# EAGLE schematic NeoPI_W_v34 (EAGLE 9.7.0)
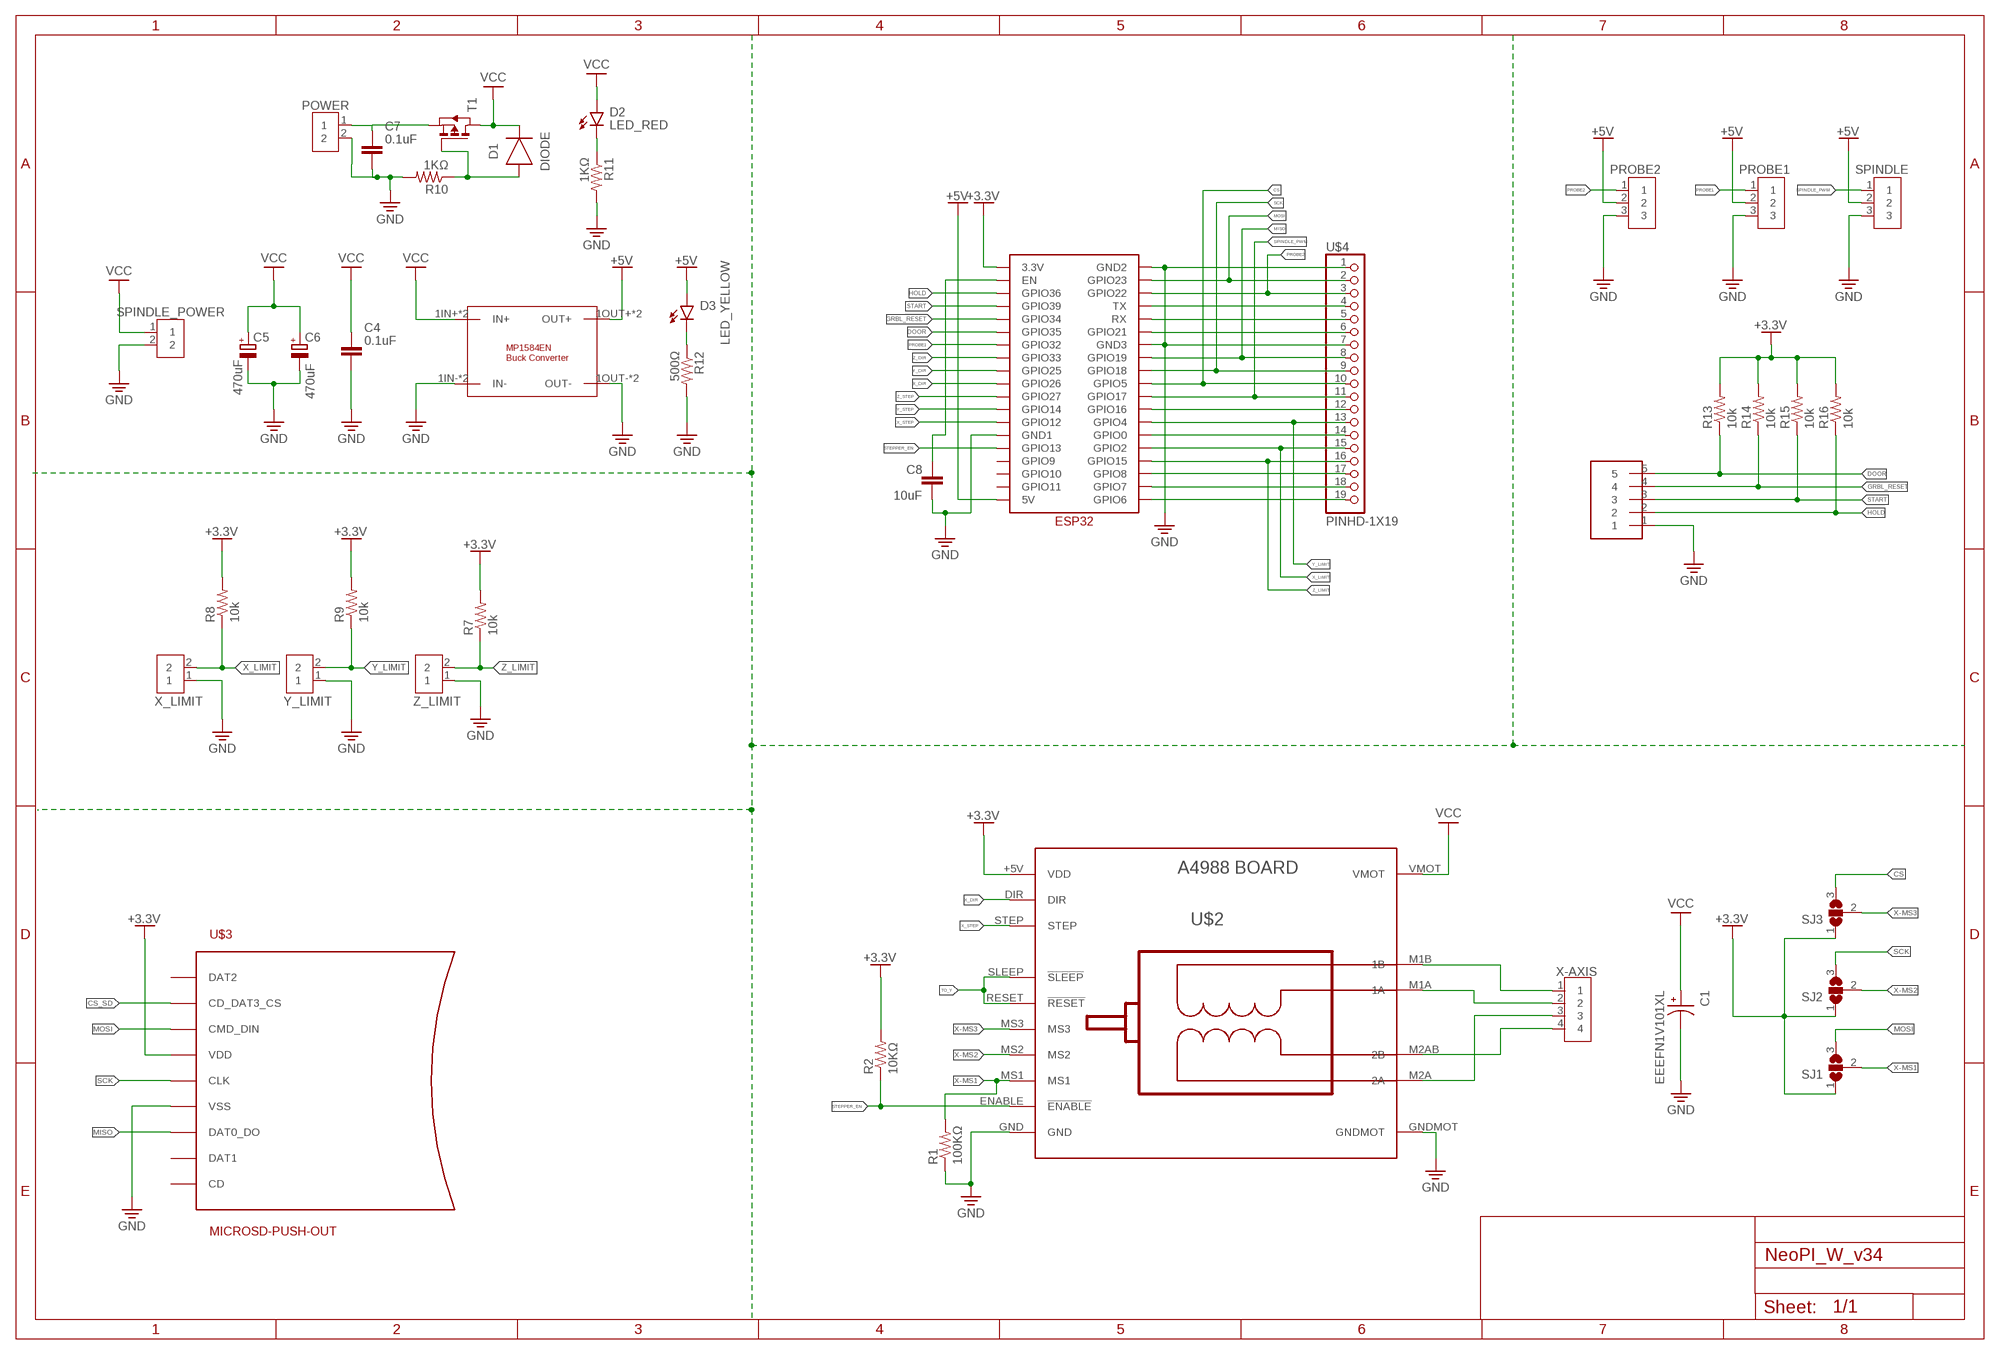
[diagram p0: schematic, sheet 1, part 1 of 2]
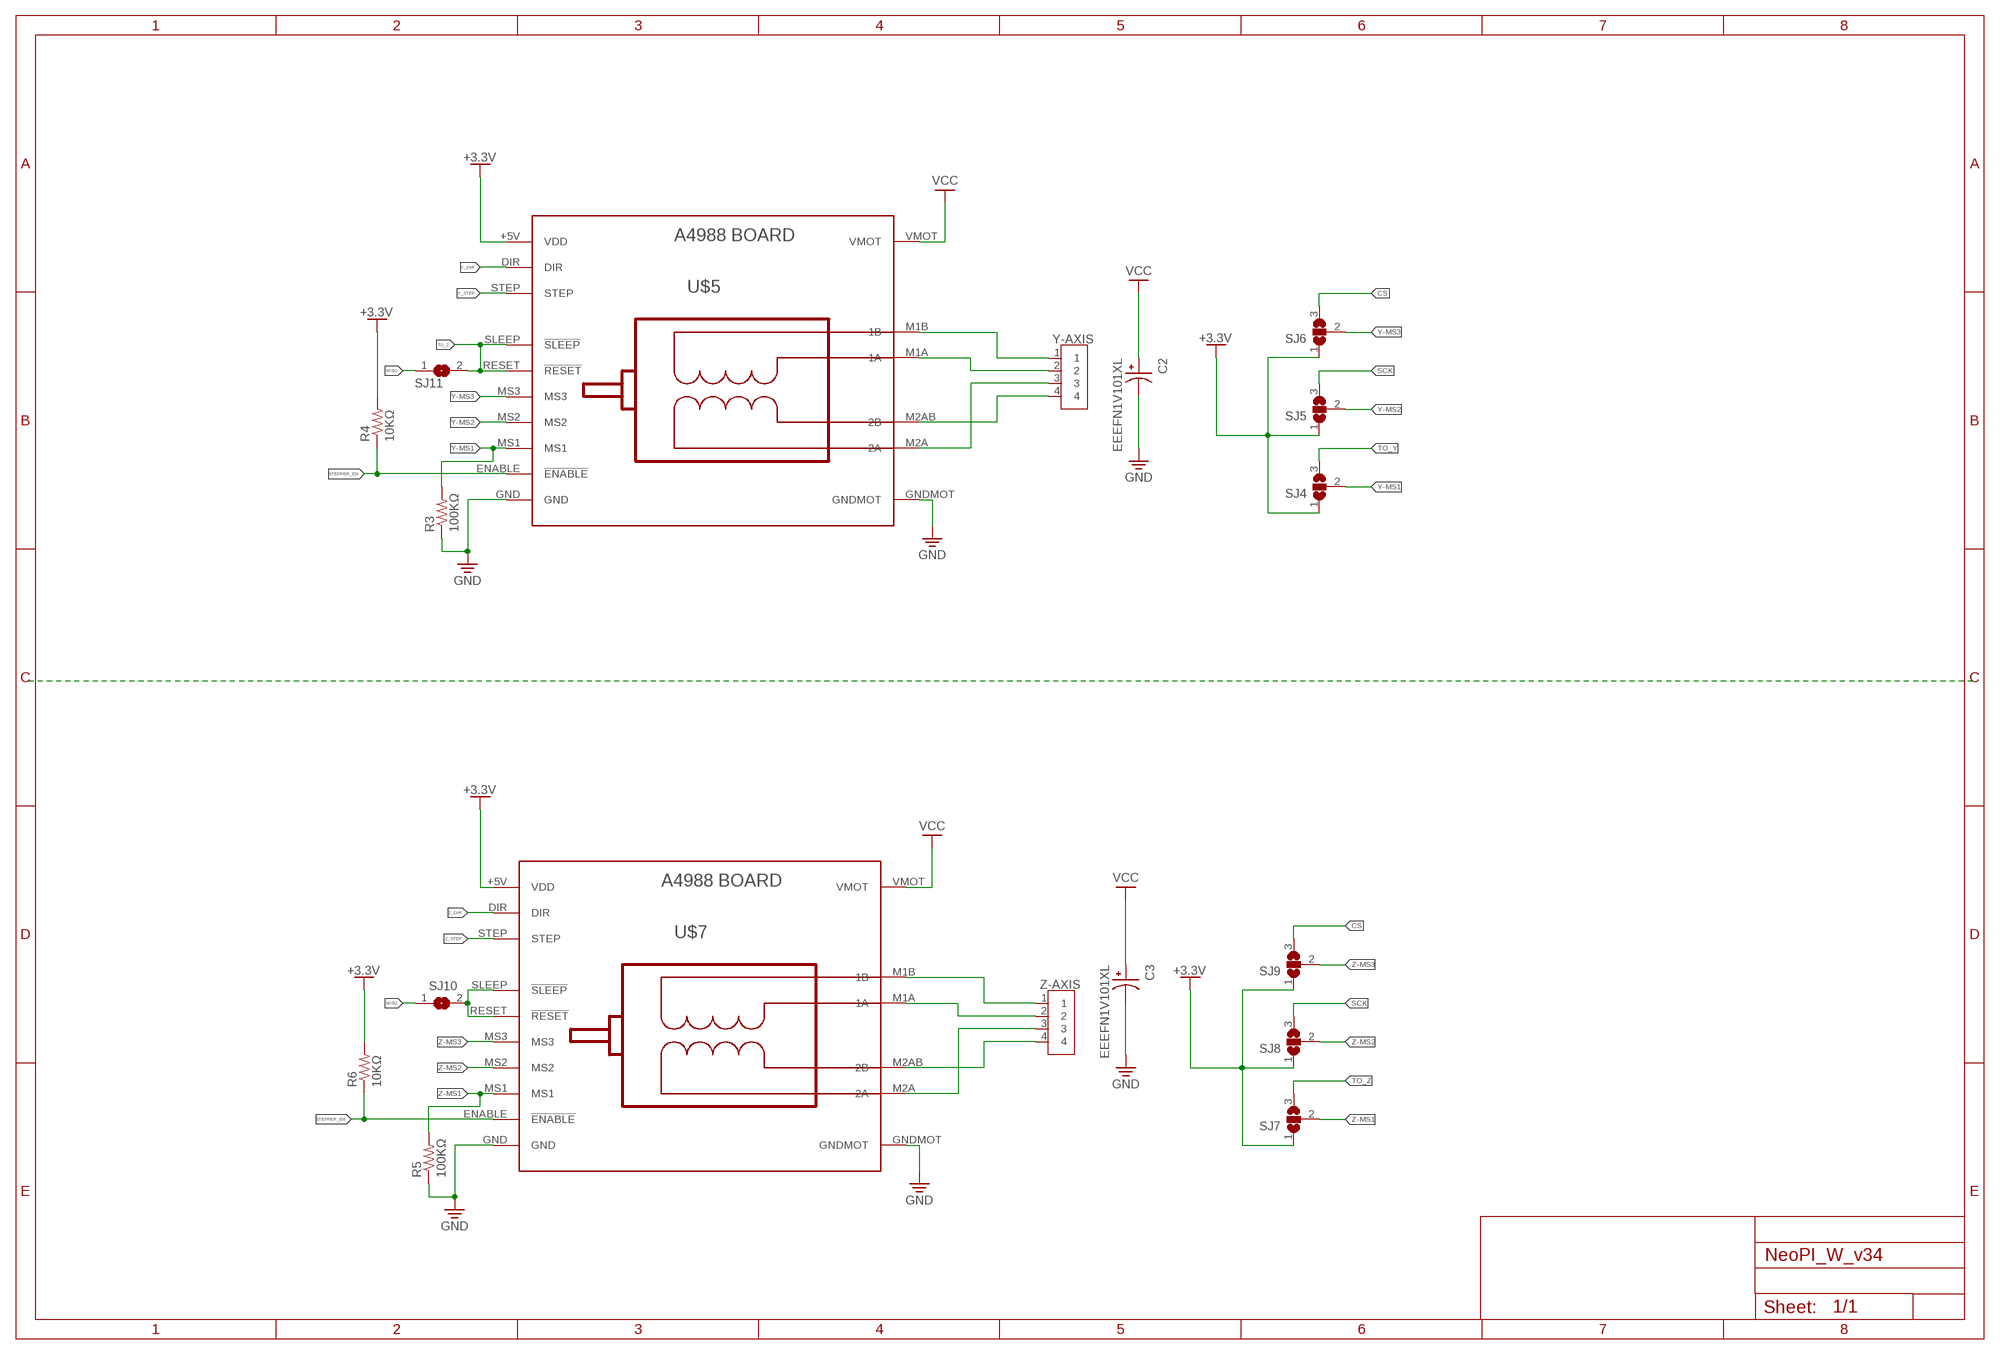
[diagram p1: schematic, sheet 1, part 2 of 2]

## Parts
C1  EEEFN1V101XL  [CAP_EEEFN1V101XL]
C2  EEEFN1V101XL  [CAP_EEEFN1V101XL]
C3  EEEFN1V101XL  [CAP_EEEFN1V101XL]
C4  0.1uF  C_CHIP-1206(3216-METRIC)  [CAPC3216X135]
C5  470uF  C-POL_ECAP-10.5MM  [CAPAE1030X1050N]
C6  470uF  C-POL_ECAP-10.5MM  [CAPAE1030X1050N]
C7  0.1uF  C_CHIP-1206(3216-METRIC)  [CAPC3216X135]
C8  10uF  C_CHIP-1206(3216-METRIC)  [CAPC3216X135]
D1  DIODE  DIODE_DO-213AB(5025-METRIC)  [DIOMELF5024]
D2  LED_RED  CHIP-FLAT-R_1206  [LEDC3216X75N_FLAT-R]
D3  LED_YELLOW  CHIP-FLAT-Y_1206  [LEDC3216X75N_FLAT-Y]
POWER  2828XX-2282837-2  [TERMBLK_508-2N]
PROBE1  2828XX-3282834-3  [TERMBLK_254-3N]
PROBE2  2828XX-3282834-3  [TERMBLK_254-3N]
R1  100KΩ  RES-US1206FAB  [R1206FAB]
R2  10KΩ  RES-US1206FAB  [R1206FAB]
R3  100KΩ  RES-US1206FAB  [R1206FAB]
R4  10KΩ  RES-US1206FAB  [R1206FAB]
R5  100KΩ  RES-US1206FAB  [R1206FAB]
R6  10KΩ  RES-US1206FAB  [R1206FAB]
R7  10k  RES-US1206FAB  [R1206FAB]
R8  10k  RES-US1206FAB  [R1206FAB]
R9  10k  RES-US1206FAB  [R1206FAB]
R10  1KΩ  RES-US1206FAB  [R1206FAB]
R11  1KΩ  RES-US1206FAB  [R1206FAB]
R12  500Ω  RES-US1206FAB  [R1206FAB]
R13  10k  RES-US1206FAB  [R1206FAB]
R14  10k  RES-US1206FAB  [R1206FAB]
R15  10k  RES-US1206FAB  [R1206FAB]
R16  10k  RES-US1206FAB  [R1206FAB]
SJ1  SJ2W  [SJ_2]
SJ2  SJ2W  [SJ_2]
SJ3  SJ2W  [SJ_2]
SJ4  SJ2W  [SJ_2]
SJ5  SJ2W  [SJ_2]
SJ6  SJ2W  [SJ_2]
SJ7  SJ2W  [SJ_2]
SJ8  SJ2W  [SJ_2]
SJ9  SJ2W  [SJ_2]
SJ10  SJ  [SJ]
SJ11  SJ  [SJ]
SPINDLE  2828XX-3282834-3  [TERMBLK_254-3N]
SPINDLE_POWER  2828XX-2282837-2  [TERMBLK_508-2N]
T1  PMOSFET  [TO252]
U$1  ESP32_GRBL  [ESP32_GRBL]
U$2  BOARD_A4988  [BOARD_A4988]
U$3  MICROSD-PUSH-OUT  [MICROSD-PUSH-OUT]
U$4  PINHD-1X19  [1X19]
U$5  BOARD_A4988  [BOARD_A4988]
U$6  MINI-360_DC-TO-DC_BUCK_CONVERTER  [MINI_BUCK_CONVERTER]
U$7  BOARD_A4988  [BOARD_A4988]
U$8  1X05_SMD  [1X05_SMD]
X-AXIS  2828XX-4282837-4  [TERMBLK_508-4N]
X_LIMIT  2828XX-2282834-2  [TERMBLK_254-2N]
Y-AXIS  2828XX-4282837-4  [TERMBLK_508-4N]
Y_LIMIT  2828XX-2282834-2  [TERMBLK_254-2N]
Z-AXIS  2828XX-4282837-4  [TERMBLK_508-4N]
Z_LIMIT  2828XX-2282834-2  [TERMBLK_254-2N]

## Nets
+3.3V: R2.2 R4.2 R6.2 R7.2 R8.2 R9.2 R13.2 R14.2 R15.2 R16.2 SJ1.1 SJ2.1 SJ3.1 SJ4.1 SJ5.1 SJ6.1 SJ7.1 SJ8.1 SJ9.1 U$1.3.3V U$2.+5V(VDD) U$3.4(VDD) U$5.+5V(VDD) U$7.+5V(VDD)
+5V: D3.A PROBE1.2 PROBE2.2 SPINDLE.2 U$1.5V U$6.1OUT+(OUT+) U$6.2OUT+(OUT+)
CS: SJ3.3 SJ6.3 SJ9.3 U$1.GPIO5 U$4.10
CS_SD: U$3.2(CD_DAT3_CS)
DOOR: R13.1 U$1.GPIO35 U$8.5
GND [gnd]: C1.2 C2.2 C3.2 C4.2 C5.2(-) C6.2(-) C7.2 C8.2 POWER.2 PROBE1.3 PROBE2.3 R1.1 R3.1 R5.1 R10.2 R11.2 R12.2 SPINDLE.3 SPINDLE_POWER.2 U$1.GND1 U$1.GND2 U$1.GND3 U$2.GND U$2.GNDMOT U$3.6(VSS) U$3.G1(VSS) U$3.G2(VSS) U$3.G3(VSS) U$3.G4(VSS) U$4.1 U$4.7 U$5.GND U$5.GNDMOT U$6.1IN-(IN-) U$6.1OUT-(OUT-) U$6.2IN-(IN-) U$6.2OUT-(OUT-) U$7.GND U$7.GNDMOT U$8.1 X_LIMIT.1 Y_LIMIT.1 Z_LIMIT.1
GRBL_RESET: R14.1 U$1.GPIO34 U$8.4
HOLD: R16.1 U$1.GPIO36 U$8.2
MISO: SJ10.1 SJ11.1 U$1.GPIO19 U$3.7(DAT0_DO) U$4.8
MOSI: SJ1.3 U$1.GPIO23 U$3.3(CMD_DIN) U$4.2
N$1 [motor_out]: U$2.M1B(1B) X-AXIS.1
N$2 [motor_out]: U$2.M1A(1A) X-AXIS.2
N$3 [motor_out]: U$2.M2A(2A) X-AXIS.3
N$4 [motor_out]: U$2.M2AB(2B) X-AXIS.4
N$5: U$1.TX U$4.4
N$6: D2.C R11.1
N$7: U$1.GPIO21 U$4.6
N$8 [motor_out]: U$5.M1B(1B) Y-AXIS.1
N$9 [motor_out]: U$5.M1A(1A) Y-AXIS.2
N$10: D3.C R12.1
N$11: C8.1 U$1.EN
N$12 [motor_out]: U$5.M2A(2A) Y-AXIS.3
N$13 [motor_out]: U$5.M2AB(2B) Y-AXIS.4
N$14 [motor_out]: U$7.M1B(1B) Z-AXIS.1
N$15 [motor_out]: U$7.M1A(1A) Z-AXIS.2
N$16: SJ10.2 U$7.RESET(!RESET) U$7.SLEEP(!SLEEP)
N$17 [motor_out]: U$7.M2A(2A) Z-AXIS.3
N$18 [motor_out]: U$7.M2AB(2B) Z-AXIS.4
N$19: U$1.RX U$4.5
N$21: U$1.GPIO16 U$4.12
N$22: C7.1 POWER.1 T1.2(S)
N$23: U$1.GPIO0 U$4.14
N$26: U$1.GPIO8 U$4.17
N$27: U$1.GPIO7 U$4.18
N$28: U$1.GPIO6 U$4.19
N$30: D1.2(A) R10.1 T1.1(G)
PROBE1: PROBE1.1 U$1.GPIO32
PROBE2: PROBE2.1 U$1.GPIO22 U$4.3
SCK: SJ2.3 SJ5.3 SJ8.3 U$1.GPIO18 U$3.5(CLK) U$4.9
SPINDLE_PWM: SPINDLE.1 U$1.GPIO17 U$4.11
START: R15.1 U$1.GPIO39 U$8.3
STEPPER_EN: R2.1 R4.1 R6.1 U$1.GPIO13 U$2.ENABLE(!ENABLE) U$5.ENABLE(!ENABLE) U$7.ENABLE(!ENABLE)
TO_Y: SJ4.3 U$2.RESET(!RESET) U$2.SLEEP(!SLEEP)
TO_Z: SJ7.3 SJ11.2 U$5.RESET(!RESET) U$5.SLEEP(!SLEEP)
VCC [vcc]: C1.1 C2.1 C3.1 C4.1 C5.1(+) C6.1(+) D1.1(C) D2.A SPINDLE_POWER.1 T1.3(D) U$2.VMOT U$5.VMOT U$6.1IN+(IN+) U$6.2IN+(IN+) U$7.VMOT
X-MS1: R1.2 SJ1.2 U$2.MS1
X-MS2: SJ2.2 U$2.MS2
X-MS3: SJ3.2 U$2.MS3
X_DIR: U$1.GPIO26 U$2.DIR
X_LIMIT: R8.1 U$1.GPIO2 U$4.15 X_LIMIT.2
X_STEP: U$1.GPIO12 U$2.STEP
Y-MS1: R3.2 SJ4.2 U$5.MS1
Y-MS2: SJ5.2 U$5.MS2
Y-MS3: SJ6.2 U$5.MS3
Y_DIR: U$1.GPIO25 U$5.DIR
Y_LIMIT: R9.1 U$1.GPIO4 U$4.13 Y_LIMIT.2
Y_STEP: U$1.GPIO14 U$5.STEP
Z-MS1: R5.2 SJ7.2 U$7.MS1
Z-MS2: SJ8.2 U$7.MS2
Z-MS3: SJ9.2 U$7.MS3
Z_DIR: U$1.GPIO33 U$7.DIR
Z_LIMIT: R7.1 U$1.GPIO15 U$4.16 Z_LIMIT.2
Z_STEP: U$1.GPIO27 U$7.STEP
Unconnected: U$1.GPIO9 U$1.GPIO10 U$1.GPIO11 U$3.1(DAT2) U$3.8(DAT1) U$3.CD

## Library data of the parts
C1-C3 = EEEFN1V101XL:EEEFN1V101XL; MANUFACTURER: Panasonic; MAXIMUM_PACKAGE_HEIGHT: 7.7mm; PARTREV: 10-Oct-19; STANDARD: Manufacturer Recommendations
C4 C7 C8 = Capacitor:C: Capacitor - Generic; CATEGORY: Capacitor
C5 C6 = Capacitor:C-POL: Capacitor Polarised - Generic; CATEGORY: Capacitor
D1 = Diode:DIODE: Diode Rectifier - Generic; CATEGORY: Diode; SUB-CATEGORY: Rectifier
D2 = LED:CHIP-FLAT-R; CATEGORY: LED; COLOR: RED; DESCRIPTION: CHIP LED FLAT; SUB-CATEGORY: CHIP; TYPE: FLAT_TOP
D3 = LED:CHIP-FLAT-Y; CATEGORY: LED; COLOR: YELLOW; DESCRIPTION: CHIP LED FLAT; SUB-CATEGORY: CHIP; TYPE: FLAT_TOP
POWER SPINDLE_POWER = Connector:2828XX-2: 2 Position Wire to Board Terminal Block Horizontal with Board Datasheet <https://www.te.com.cn/commerce/DocumentDelivery/DDEController?Action=showdoc&DocId=Catalog+Section%7F1308389_EUROSTYLE_TERMINAL_BLOCKS%7F0607%7Fpdf%7FEnglish%7FENG_CS_1308389_EUROSTYLE_TERMINAL_BLOCKS_0607.pdf%7F2-282837-5>; CATEGORY: Connector; DESCRIPTION: 2 Position Wire to Board Terminal Block Horizontal with Board 5.08 mm Through Hole; MANUFACTURER: TE Connectivity; MPN: 282837-2; OPERATING_TEMPERATURE: -40°C to +105°C; PART_STATUS: ACTIVE; ROHS_COMPLIANCE: RoHS Compliant; SERIES: 282837; SUBCATEGORY: Terminal Block; TYPE: Side Wire Entry
PROBE1 PROBE2 SPINDLE = Connector:2828XX-3: 3 Position Wire to Board Terminal Block Horizontal with Board Datasheet <https://www.te.com.cn/commerce/DocumentDelivery/DDEController?Action=showdoc&DocId=Catalog+Section%7F1308389_EUROSTYLE_TERMINAL_BLOCKS%7F0607%7Fpdf%7FEnglish%7FENG_CS_1308389_EUROSTYLE_TERMINAL_BLOCKS_0607.pdf%7F2-282837-5>; CATEGORY: Connector; DESCRIPTION: TERM BLK 3P SIDE ENT 2.54mm PCB; MANUFACTURER: TE Connectivity; MPN: 282834-3; OPERATING_TEMPERATURE: -40°C to +105°C; PART_STATUS: Active; ROHS_COMPLIANCE: RoHS Compliant; SERIES: 282834; SUBCATEGORY: Terminal Block; TYPE: Side Wire Entry
R1-R16 = files_fab:RES-US: Resistor (US Symbol) Variants with postfix FAB are widened to allow the routing of internal traces
SJ1-SJ9 = jumper:SJ2W: SMD solder JUMPER
SJ10 SJ11 = jumper:SJ: SMD solder JUMPER
T1 = files_fab:PMOSFET: MOS FET
U$1 = ESP32-GRBL:ESP32_GRBL
U$2 U$5 U$7 = Clean-Kong:BOARD_A4988
U$3 = microsd:MICROSD-PUSH-OUT: T-Flash Push-Out Micro SD Card Reader 14.75mm x 14.5mm SMD with external pins
U$4 = files_fab:PINHD-1X19
U$6 = MINI-BUCK-CONVERTER:MINI-360_DC-TO-DC_BUCK_CONVERTER
U$8 = files_fab:1X05_SMD
X-AXIS Y-AXIS Z-AXIS = Connector:2828XX-4: 4 Position Wire to Board Terminal Block Horizontal with Board Datasheet <https://www.te.com.cn/commerce/DocumentDelivery/DDEController?Action=showdoc&DocId=Catalog+Section%7F1308389_EUROSTYLE_TERMINAL_BLOCKS%7F0607%7Fpdf%7FEnglish%7FENG_CS_1308389_EUROSTYLE_TERMINAL_BLOCKS_0607.pdf%7F2-282837-5>; CATEGORY: Connector; DESCRIPTION: TERM BLK 4P SIDE ENT 5.08mm PCB; MANUFACTURER: TE Connectivity; MPN: 282837-4; OPERATING_TEMPERATURE: 40°C to +105°C; PART_STATUS: Active; ROHS_COMPLIANCE: RoHS Compliant; SERIES: 283737; SUBCATEGORY: Terminal Block; TYPE: Side Wire Entry
X_LIMIT Y_LIMIT Z_LIMIT = Connector:2828XX-2: 2 Position Wire to Board Terminal Block Horizontal with Board Datasheet <https://www.te.com.cn/commerce/DocumentDelivery/DDEController?Action=showdoc&DocId=Catalog+Section%7F1308389_EUROSTYLE_TERMINAL_BLOCKS%7F0607%7Fpdf%7FEnglish%7FENG_CS_1308389_EUROSTYLE_TERMINAL_BLOCKS_0607.pdf%7F2-282837-5>

## Net classes
1 vcc: width 1.016 mm, drill 0.8 mm, clearance 0.508 mm
2 motor_out: width 0.762 mm, drill 0.8 mm, clearance 0.508 mm
3 +5vcc: width 0.406 mm, drill 0.8 mm, clearance 0.508 mm